# EAGLE design schmatic (EAGLE 9.6.0)
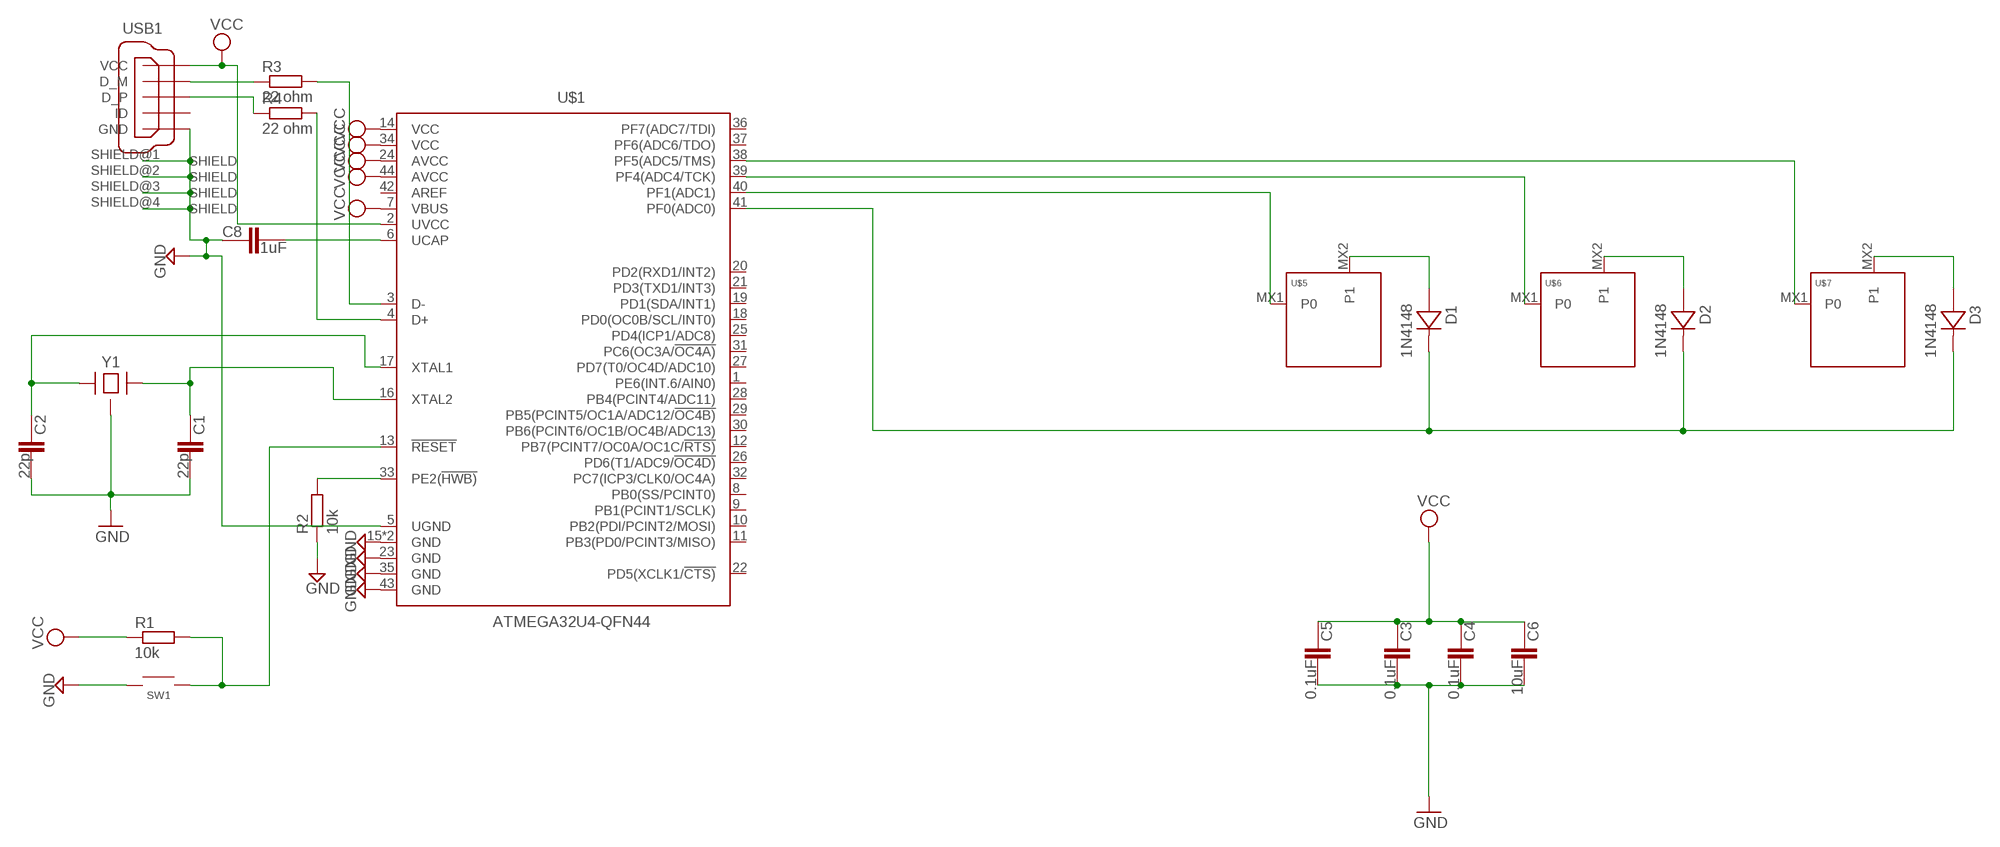
[diagram p0: schematic, sheet 1]

## Parts
C1  22p  CAPACITOR-0402  [C0402]
C2  22p  CAPACITOR-0402  [C0402]
C3  0.1uF  CAPACITOR-0402  [C0402]
C4  0.1uF  CAPACITOR-0402  [C0402]
C5  0.1uF  CAPACITOR-0402  [C0402]
C6  10uF  CAPACITOR-0402  [C0402]
C8  1uF  CAPACITOR-0402  [C0402]
D1  1N4148  DIODE-DO-35  [DO-35]
D2  1N4148  DIODE-DO-35  [DO-35]
D3  1N4148  DIODE-DO-35  [DO-35]
R1  10k  RESISTOR-0405  [R0402]
R2  10k  RESISTOR-0405  [R0402]
R3  22 ohm  RESISTOR-0405  [R0402]
R4  22 ohm  RESISTOR-0405  [R0402]
SW1  SWITCH-SMD-EVQP-P2602W  [SWITCH-SMD-EVQP-P2602W]
U$1  ATMEGA32U4-QFN44  [QFN-44]
U$5  KEYSWITCH-PLAIN-MXHSPCB-1U  [MXHSPCB-1U]
U$6  KEYSWITCH-PLAIN-MXHSPCB-1U  [MXHSPCB-1U]
U$7  KEYSWITCH-PLAIN-MXHSPCB-1U  [MXHSPCB-1U]
USB1  USB_CONN-MICRO-FEMALE  [ZB62D-B-5PA8]
Y1  CRYSTAL-4PIN-3.2X2.5  [CRYSTAL-3.2X2.5]

## Nets
GND: C1.2 C2.2 C3.2 C4.2 C5.2 C6.2 C8.1 R2.1 SW1.1A SW1.1B U$1.5(UGND) U$1.15(GND) U$1.23(GND) U$1.35(GND) U$1.43(GND) U$1.TAB(GND) USB1.5(GND) USB1.SHIELD@1(SHIELD) USB1.SHIELD@2(SHIELD) USB1.SHIELD@3(SHIELD) USB1.SHIELD@4(SHIELD) Y1.2(GND) Y1.4(GND)
N$1: C2.1 U$1.17(XTAL1) Y1.1
N$2: C1.1 U$1.16(XTAL2) Y1.3
N$3: R1.2 SW1.2A SW1.2B U$1.13(!RESET)
N$4: R2.2 U$1.33(PE2(!HWB))
N$5: R3.1 USB1.2(D_M)
N$6: R3.2 U$1.3(D-)
N$7: R4.2 U$1.4(D+)
N$8: R4.1 USB1.3(D_P)
N$9: U$1.39(PF4(ADC4/TCK)) U$6.MX1(P0)
N$10: C8.2 U$1.6(UCAP)
N$13: D1.C D2.C D3.C U$1.41(PF0(ADC0))
N$14: U$1.40(PF1(ADC1)) U$5.MX1(P0)
N$15: U$1.38(PF5(ADC5/TMS)) U$7.MX1(P0)
N$17: D1.A U$5.MX2(P1)
N$18: D2.A U$6.MX2(P1)
N$19: D3.A U$7.MX2(P1)
VCC: C3.1 C4.1 C5.1 C6.1 R1.1 U$1.2(UVCC) U$1.7(VBUS) U$1.14(VCC) U$1.24(AVCC) U$1.34(VCC) U$1.44(AVCC) USB1.1(VCC)
Unconnected: U$1.1(PE6(INT.6/AIN0)) U$1.8(PB0(SS/PCINT0)) U$1.9(PB1(PCINT1/SCLK)) U$1.10(PB2(PDI/PCINT2/MOSI)) U$1.11(PB3(PD0/PCINT3/MISO)) U$1.12(PB7(PCINT7/OC0A/OC1C/!RTS)) U$1.18(PD0(OC0B/SCL/INT0)) U$1.19(PD1(SDA/INT1)) U$1.20(PD2(RXD1/INT2)) U$1.21(PD3(TXD1/INT3)) U$1.22(PD5(XCLK1/!CTS)) U$1.25(PD4(ICP1/ADC8)) U$1.26(PD6(T1/ADC9/!OC4D)) U$1.27(PD7(T0/OC4D/ADC10)) U$1.28(PB4(PCINT4/ADC11)) U$1.29(PB5(PCINT5/OC1A/ADC12/!OC4B)) U$1.30(PB6(PCINT6/OC1B/OC4B/ADC13)) U$1.31(PC6(OC3A/!OC4A)) U$1.32(PC7(ICP3/CLK0/OC4A)) U$1.36(PF7(ADC7/TDI)) U$1.37(PF6(ADC6/TDO)) U$1.42(AREF) USB1.4(ID)

## Library data of the parts
C1-C6 C8 = Components:CAPACITOR
D1-D3 = Components:DIODE: Standard 1N4148 diode
R1-R4 = Components:RESISTOR
SW1 = Hardware:SWITCH-SMD
U$1 = MCU:ATMEGA32U4
U$5-U$7 = Keyboard:KEYSWITCH-PLAIN
USB1 = USB:USB_CONN
Y1 = Components:CRYSTAL-4PIN

## Board
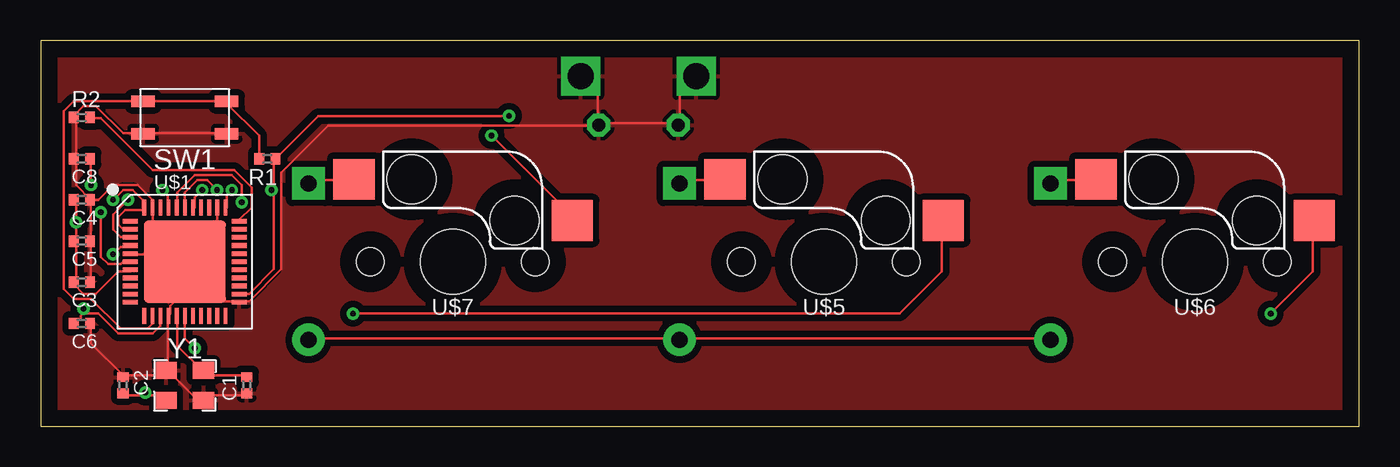
[diagram p1: board, top side]
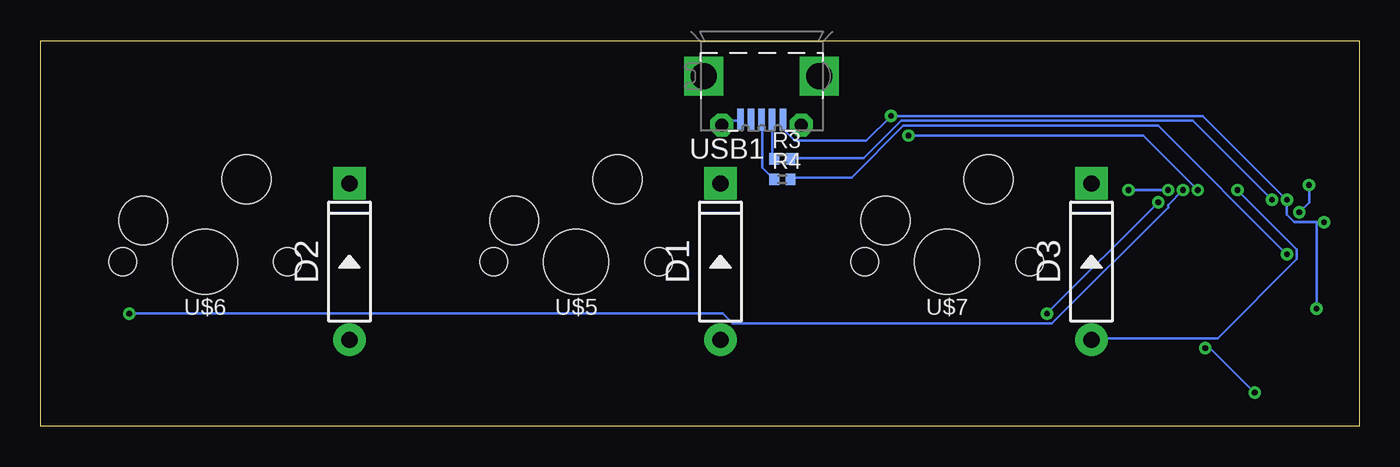
[diagram p2: board, bottom side, seen from below]

Size 81.26 x 23.8 mm. Coordinates in mm from the lower left corner, seen from the top.
Outline: 0,0 81.26,0 81.26,23.8 0,23.8 0,0
Copper layers (1*16): Top 0.035mm / dielectric 1.5mm / Bottom 0.035mm
Design rules "default": minimum track width 6mil, minimum drill 0.35mm, track to track 6mil, track to pad 6mil, pad to pad 6mil, via to via 6mil, smd to smd 6mil, copper to edge 40mil, drill to drill 6mil, minimum pad ring 10mil, minimum via ring 8mil, stop-mask expansion 4mil, vias tented up to drill 0mil, thermal gap 10mil

### Footprints (pad centres in the part's own frame; a part is rotated, then mirrored left to right if it is on the bottom)
C0402 = smd 0.6 x 0.7: 1 -0.5,0; 2 0.5,0
DO-35 = drill 1 pad 2 square: A 4.82,0 | drill 1 pad 2: C -4.82,0
R0402 = smd 0.6 x 0.7: 1 -0.5,0; 2 0.5,0
SWITCH-SMD-EVQP-P2602W = smd 1.45 x 0.7: 1A -2.57,-1; 1B 2.57,-1; 2A -2.57,1; 2B 2.57,1
QFN-44 = smd 1 x 0.3: 1 -3.35,2.5; 2 -3.35,2; 3 -3.35,1.5; 4 -3.35,1; 5 -3.35,0.5; 6 -3.35,0; 7 -3.35,-0.5; 8 -3.35,-1; 9 -3.35,-1.5; 10 -3.35,-2; 11 -3.35,-2.5; 23 3.35,-2.5; 24 3.35,-2; 25 3.35,-1.5; 26 3.35,-1; 27 3.35,-0.5; 28 3.35,0; 29 3.35,0.5; 30 3.35,1; 31 3.35,1.5; 32 3.35,2; 33 3.35,2.5 | smd 0.3 x 1: 12 -2.5,-3.35; 13 -2,-3.35; 14 -1.5,-3.35; 15 -1,-3.35; 16 -0.5,-3.35; 17 0,-3.35; 18 0.5,-3.35; 19 1,-3.35; 20 1.5,-3.35; 21 2,-3.35; 22 2.5,-3.35; 34 2.5,3.35; 35 2,3.35; 36 1.5,3.35; 37 1,3.35; 38 0.5,3.35; 39 0,3.35; 40 -0.5,3.35; 41 -1,3.35; 42 -1.5,3.35; 43 -2,3.35; 44 -2.5,3.35 | smd 5.08 x 5.08: TAB 0,0
MXHSPCB-1U = smd 2.55 x 2.5: MX1 7.36,2.54; MX2 -6.09,5.08 | hole 4: 0,0 | hole 1.7: 5.08,0; -5.08,0 | hole 3: 3.81,2.54; -2.54,5.08
ZB62D-B-5PA8 = smd 1.35 x 0.4: 1 0.135,1.3; 2 0.135,0.65; 3 0.135,0; 4 0.135,-0.65; 5 0.135,-1.3 | drill 0.8 pad 1.422 octagon: SHIELD@1 0.46,2.45; SHIELD@2 0.46,-2.45 | drill 1.6 square: SHIELD@3 -2.54,3.556; SHIELD@4 -2.54,-3.556
CRYSTAL-3.2X2.5 = smd 1.3 x 1.05: 1 -1.15,-0.925; 2 1.15,-0.925; 3 1.15,0.925; 4 -1.15,0.925

### Placement (x,y rotation side)
C1  12.7,2.54 270 top
C2  5.08,2.54 90 top
C3  2.54,8.89 0 top
C4  2.54,13.97 0 top
C5  2.54,11.43 0 top
C6  2.54,6.35 0 top
C8  2.54,16.51 0 top
D1  39.37,10.16 90 bottom
D2  62.23,10.16 90 bottom
D3  16.51,10.16 90 bottom
R1  13.97,16.51 180 top
R2  2.54,19.05 0 top
R3  35.56,16.51 0 bottom
R4  35.56,15.24 0 bottom
SW1  8.89,19.05 0 top
U$1  8.89,10.16 0 top
U$5  48.26,10.16 0 top
U$6  71.12,10.16 0 top
U$7  25.4,10.16 0 top
USB1  36.83,19.05 270 bottom
Y1  8.89,2.54 0 top

### Tracks (layer width: path | path; a pad name or v marks a point on that pad's centre or on a via)
GND
  Top 0.152: USB1.SHIELD@3 34.34,20.52 34.34,18.69 USB1.SHIELD@1 | USB1.SHIELD@4 40.28,21.59 39.37,20.68 39.37,18.69 USB1.SHIELD@2 39.22,18.69 34.49,18.69 USB1.SHIELD@1 | SW1.1B 11.33,18.09 6.45,18.09 SW1.1A 6.3,18.09 5.08,18.09 3.4,19.76 2.64,19.76 2.03,19.15 R2.1 2.18,19 2.18,16.56 C8.1 2.18,16.41 2.18,14.88 3.1,13.97 | C3.2 3.1,8.94 3.1,11.38 C5.2 3.1,11.53 3.1,13.97 | 6.91,10.62 8.43,10.62 8.59,10.46 | 6.91,10.62 5.69,10.62 U$1.5 | 6.91,10.62 6.91,13.36 U$1.43 6.91,13.51 6.91,13.97 5.99,14.88 4.47,14.88 3.56,13.97 3.1,13.97 | 6.91,10.62 U$1.TAB | 9.8,9.25 11.33,7.72 12.09,7.72 U$1.23 12.24,7.72 12.85,7.72 14.83,9.7 14.83,15.65 17.73,18.54 34.34,18.54 USB1.SHIELD@1 | 8.59,10.46 10.87,12.75 10.87,13.36 U$1.35 | 8.59,10.46 U$1.TAB | C1.2 12.7,1.93 10.41,1.93 10.11,1.63 Y1.2 9.96,1.63 9.65,1.63 7.82,3.45 Y1.4 | 5.08,3.15 7.37,3.15 7.67,3.45 Y1.4 | 5.08,3.15 3.1,5.13 3.1,6.35 C6.2 | 5.08,3.15 C2.2 | Y1.4 7.82,3.61 7.82,6.81 U$1.15 7.98,6.96 7.98,7.42 9.8,9.25 | 9.8,9.25 U$1.TAB | 3.1,13.97 C4.2
  Bottom 0.152: USB1.5 38.15,18.85 39.06,18.85 39.22,18.69 USB1.SHIELD@2
  pour Top (isolate 0.406): 0,22.86 0,0 81.28,0 81.28,22.86
N$1  (via drill 0.35)
  Top 0.152: 6.45,1.93 7.37,1.93 7.67,1.63 Y1.1 | 6.45,1.93 5.08,1.93 C2.1 | U$1.17 8.89,5.44 v9.5,4.83 | 6.45,1.93 v6.45,2.08
  Bottom 0.152: v9.5,4.83 9.2,4.83 v6.45,2.08
N$2
  Top 0.152: C1.1 12.7,3.15 10.41,3.15 10.11,3.45 Y1.3 9.96,3.45 8.43,4.98 8.43,6.81 U$1.16
N$3
  Top 0.152: R1.2 13.46,16.56 13.46,17.93 11.48,19.91 SW1.2B 11.33,20.07 6.45,20.07 SW1.2A 6.3,20.07 2.03,20.07 1.42,19.46 1.42,8.48 2.03,7.87 3.1,7.87 4.93,6.04 6.6,6.04 6.91,6.35 6.91,6.81 U$1.13
N$4
  Top 0.152: R2.2 3.1,19 3.71,19 6.91,15.8 11.94,15.8 13,14.73 13,13.51 12.24,12.75 U$1.33
N$5
  Bottom 0.152: R3.1 36.17,16.56 36.17,18.85 USB1.2
N$6  (via drill 0.35)
  Top 0.152: v5.39,13.97 4.47,13.06 4.47,12.14 4.93,11.68 5.54,11.68 U$1.3
  Bottom 0.152: v5.39,13.97 10.26,18.85 28.25,18.85 30.53,16.56 34.95,16.56 R3.2
N$7  (via drill 0.35)
  Top 0.152: v4.47,10.62 4.93,11.07 5.54,11.07 U$1.4
  Bottom 0.152: v4.47,10.62 12.39,18.54 28.09,18.54 31.29,15.34 34.95,15.34 R4.2
N$8
  Bottom 0.152: R4.1 36.17,15.34 36.78,15.95 36.78,18.85 USB1.3
N$9  (via drill 0.35)
  Top 0.152: U$1.39 8.89,14.43 9.65,15.19 10.26,15.19 v10.87,14.58 | v75.79,6.96 78.38,9.55 78.38,12.6 U$6.MX1
  Bottom 0.152: v10.87,14.58 11.79,13.66 11.79,13.51 18.95,6.35 38.61,6.35 39.22,6.96 v75.79,6.96
N$10  (via drill 0.35)
  Top 0.152: v3.1,14.88 3.1,16.41 C8.2 | v3.71,13.21 3.71,10.46 4.17,10.01 4.93,10.01 5.08,10.16 U$1.6
  Bottom 0.152: v3.1,14.88 3.1,13.82 v3.71,13.21
N$13  (via drill 0.35)
  Top 0.152: v7.52,14.58 7.82,14.27 7.82,13.51 U$1.41 | 39.37,5.44 16.51,5.44 D3.C | 39.37,5.44 62.23,5.44 D2.C | 39.37,5.44 D1.C
  Bottom 0.152: v7.52,14.58 3.86,10.92 3.86,10.31 8.74,5.44 16.51,5.44 D3.C
N$14  (via drill 0.35)
  Top 0.152: v12.39,13.82 12.39,14.88 11.79,15.49 9.5,15.49 8.43,14.43 8.43,13.51 U$1.40 | v19.25,6.96 52.93,6.96 55.52,9.55 55.52,12.6 U$5.MX1
  Bottom 0.152: v19.25,6.96 v12.39,13.82
N$15  (via drill 0.35)
  Top 0.152: v9.96,14.58 9.5,14.12 9.5,13.51 U$1.38 | v27.79,17.93 32.66,13.06 32.66,12.75 U$7.MX1
  Bottom 0.152: v9.96,14.58 13.31,17.93 v27.79,17.93
N$17
  Top 0.152: U$5.MX2 42.11,15.19 39.52,15.19 39.37,15.04 D1.A
N$18
  Top 0.152: U$6.MX2 64.97,15.19 62.38,15.19 62.23,15.04 D2.A
N$19
  Top 0.152: U$7.MX2 19.25,15.19 16.66,15.19 16.51,15.04 D3.A
VCC  (via drill 0.35)
  Top 0.152: 2.64,6.96 2.49,6.81 2.49,6.66 2.18,6.35 C6.1 | 2.64,6.96 3.56,6.96 4.78,5.74 6.91,5.74 7.37,6.2 7.37,6.81 U$1.14 | U$1.2 5.54,12.14 5.08,12.14 4.78,12.45 4.78,12.9 5.23,13.36 6.3,13.36 U$1.44 6.3,13.51 6.3,13.97 5.69,14.58 5.08,14.58 v4.47,13.97 | C4.1 2.18,13.97 v2.18,12.6 2.18,11.53 C5.1 2.18,11.38 2.18,8.94 C3.1 2.03,8.79 2.64,8.18 3.4,8.18 4.78,9.55 5.54,9.55 U$1.7 | v2.64,7.26 2.64,6.96 | 14.38,14.58 14.38,9.7 12.85,8.18 12.24,8.18 U$1.24 | 14.38,14.58 14.38,16.41 R1.1 14.53,16.56 17.12,19.15 v28.85,19.15 | v11.79,14.58 11.48,14.27 11.48,13.51 U$1.34 | 14.38,14.58 v14.22,14.58
  Bottom 0.152: v2.18,12.6 2.64,12.6 | 2.64,12.6 4.01,12.6 4.47,13.06 v4.47,13.97 9.65,19.15 v28.85,19.15 30.38,17.63 34.8,17.63 35.41,18.24 35.41,18.85 USB1.1 | 2.64,12.6 v2.64,7.26 | v14.22,14.58 v11.79,14.58